# EAGLE design valentines-heart-punk-r1.1 (EAGLE 5.12)
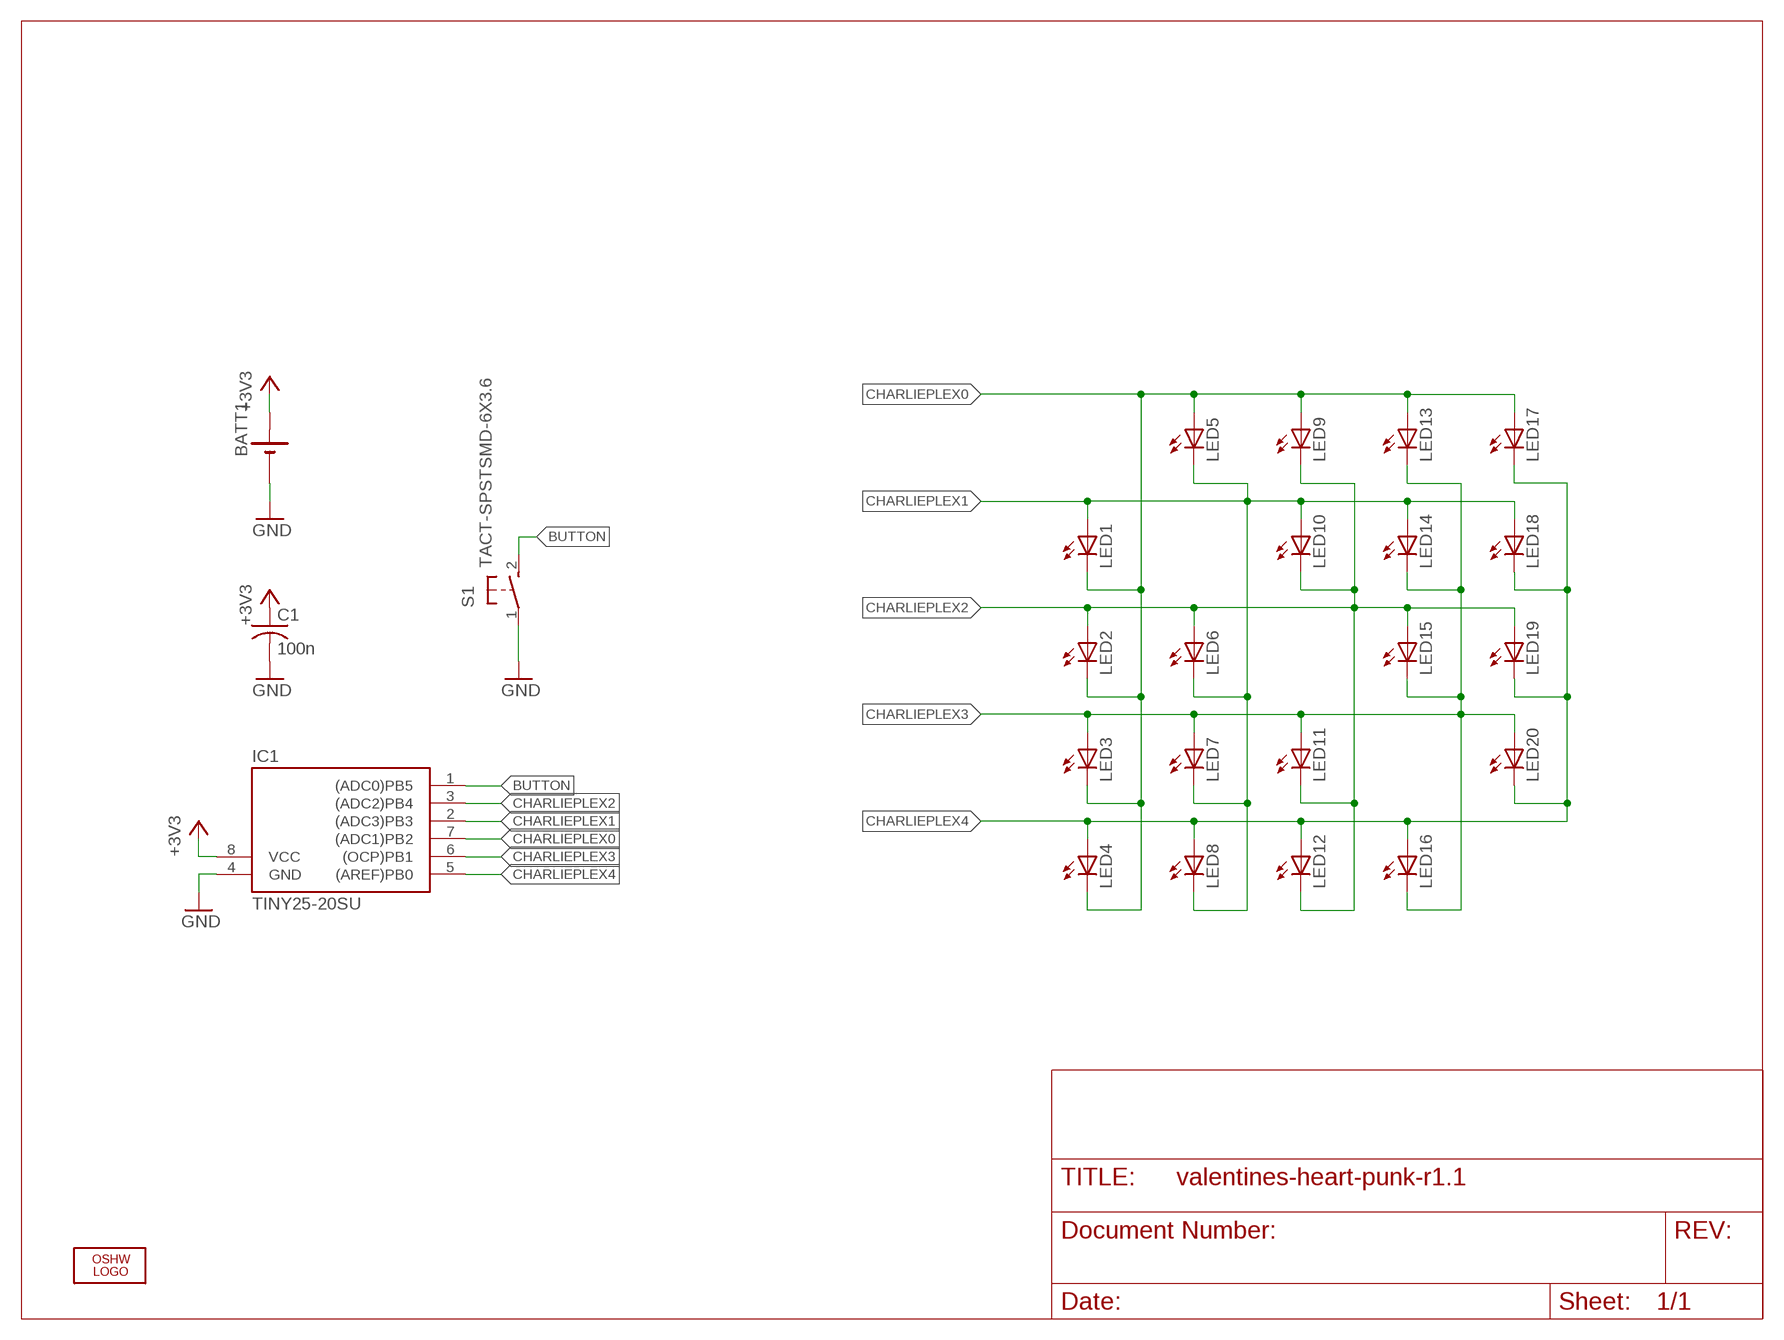
[diagram p0: schematic, sheet 1]

## Parts
BATT1  2032SMD  [2032SMD]
C1  100n  C-USC0603  [C0603]
IC1  TINY25-20SU  [SOIC8]
LED1  LEDCHIPLED_0805  [CHIPLED_0805]
LED2  LEDCHIPLED_0805  [CHIPLED_0805]
LED3  LEDCHIPLED_0805  [CHIPLED_0805]
LED4  LEDCHIPLED_0805  [CHIPLED_0805]
LED5  LEDCHIPLED_0805  [CHIPLED_0805]
LED6  LEDCHIPLED_0805  [CHIPLED_0805]
LED7  LEDCHIPLED_0805  [CHIPLED_0805]
LED8  LEDCHIPLED_0805  [CHIPLED_0805]
LED9  LEDCHIPLED_0805  [CHIPLED_0805]
LED10  LEDCHIPLED_0805  [CHIPLED_0805]
LED11  LEDCHIPLED_0805  [CHIPLED_0805]
LED12  LEDCHIPLED_0805  [CHIPLED_0805]
LED13  LEDCHIPLED_0805  [CHIPLED_0805]
LED14  LEDCHIPLED_0805  [CHIPLED_0805]
LED15  LEDCHIPLED_0805  [CHIPLED_0805]
LED16  LEDCHIPLED_0805  [CHIPLED_0805]
LED17  LEDCHIPLED_0805  [CHIPLED_0805]
LED18  LEDCHIPLED_0805  [CHIPLED_0805]
LED19  LEDCHIPLED_0805  [CHIPLED_0805]
LED20  LEDCHIPLED_0805  [CHIPLED_0805]
LOGO1  OSHW_LOGO_FILLX0100-NT  [OSHW_FILLX100_NOTEXT]
S1  TACT-SPSTSMD-6X3.6  [6X3.6-SPST]

## Nets
+3V3: BATT1.+ C1.1 IC1.8(VCC)
BUTTON: IC1.1((ADC0)PB5) S1.2(S)
CHARLIEPLEX0: IC1.7((ADC1)PB2) LED1.C LED2.C LED3.C LED4.C LED5.A LED9.A LED13.A LED17.A
CHARLIEPLEX1: IC1.2((ADC3)PB3) LED1.A LED5.C LED6.C LED7.C LED8.C LED10.A LED14.A LED18.A
CHARLIEPLEX2: IC1.3((ADC2)PB4) LED2.A LED6.A LED9.C LED10.C LED11.C LED12.C LED15.A LED19.A
CHARLIEPLEX3: IC1.6((OCP)PB1) LED3.A LED7.A LED11.A LED13.C LED14.C LED15.C LED16.C LED20.A
CHARLIEPLEX4: IC1.5((AREF)PB0) LED4.A LED8.A LED12.A LED16.A LED17.C LED18.C LED19.C LED20.C
GND: BATT1.- C1.2 IC1.4(GND) S1.1(P)

## Library data of the parts
BATT1 = rbg-4ucon-battery:2032SMD
C1 = rcl:C-US: CAPACITOR, American symbol
IC1 = avr-5-4.16:TINY25
LED1-LED20 = led:LED: LED OSRAM: - CHIPLED LG R971, LG N971, LY N971, LG Q971, LY Q971, LO R971, LY R971 LH N974, LH R974 LS Q976, LO Q976, LY Q976 LO Q996 - Hyper CHIPLED LW Q18S LB Q993, LB Q99A, LB R99A - SideLED LS A670, LO A670, LY A670, LG A670, LP A670 LB A673, LV A673, LT A673, LW A673 LH A674 LY A675 LS A676, LA A676, LO A676, LY A676, LW A676 LS A679, LY A679, LG A679 - Hyper Micro SIDELED® LS Y876, LA Y876, LO Y876, LY Y876 LT Y87S - SmartLED LW L88C, LW L88S LB L89C, LB L89S, LG L890 LS L89K, LO L89K, LY L89K LS L896, LA L896, LO L896, LY L896 - TOPLED LS T670, LO T670, LY T670, LG T670, LP T670 LSG T670, LSP T670, LSY T670, LOP T670, LYG T670 LG T671, LOG T671, LSG T671 LB T673, LV T673, LT T673, LW T673 LH T674 LS T676, LA T676, LO T676, LY T676, LB T676, LH T676, LSB T676, LW T676 LB T67C, LV T67C, LT T67C, LS T67K, LO T67K, LY T67K, LW E67C LS E67B, LA E67B, LO E67B, LY E67B, LB E67C, LV E67C, LT E67C LW T67C LS T679, LY T679, LG T679 LS T770, LO T770, LY T770, LG T770, LP T770 LB T773, LV T773, LT T773, LW T773 LH T774 LS E675, LA E675, LY E675, LS T675 LS T776, LA T776, LO T776, LY T776, LB T776 LHGB T686 LT T68C, LB T68C - Hyper Mini TOPLED® LB M676 - Mini TOPLED Santana® LG M470 LS M47K, LO M47K, LY M47K Source: http://www.osram.convergy.de LUXEON: - LUMILED® LXK2-PW12-R00, LXK2-PW12-S00, LXK2-PW14-U00, LXK2-PW14-V00 LXK2-PM12-R00, LXK2-PM12-S00, LXK2-PM14-U00 LXK2-PE12-Q00, LXK2-PE12-R00, LXK2-PE12-S00, LXK2-PE14-T00, LXK2-PE14-U00 LXK2-PB12-K00, LXK2-PB12-L00, LXK2-PB12-M00, LXK2-PB14-N00, LXK2-PB14-P00, LXK2-PB14-Q00 LXK2-PR12-L00, LXK2-PR12-M00, LXK2-PR14-Q00, LXK2-PR14-R00 LXK2-PD12-Q00, LXK2-PD12-R00, LXK2-PD12-S00 LXK2-PH12-R00, LXK2-PH12-S00 LXK2-PL12-P00, LXK2-PL12-Q00, LXK2-PL12-R00 Source: www.luxeon.com KINGBRIGHT: KA-3528ASYC Source: www.kingbright.com
LOGO1 = ohw-logo:OSHW_LOGO_FILL
S1 = rbg-generic-tact-switch:TACT-SPST

## Board
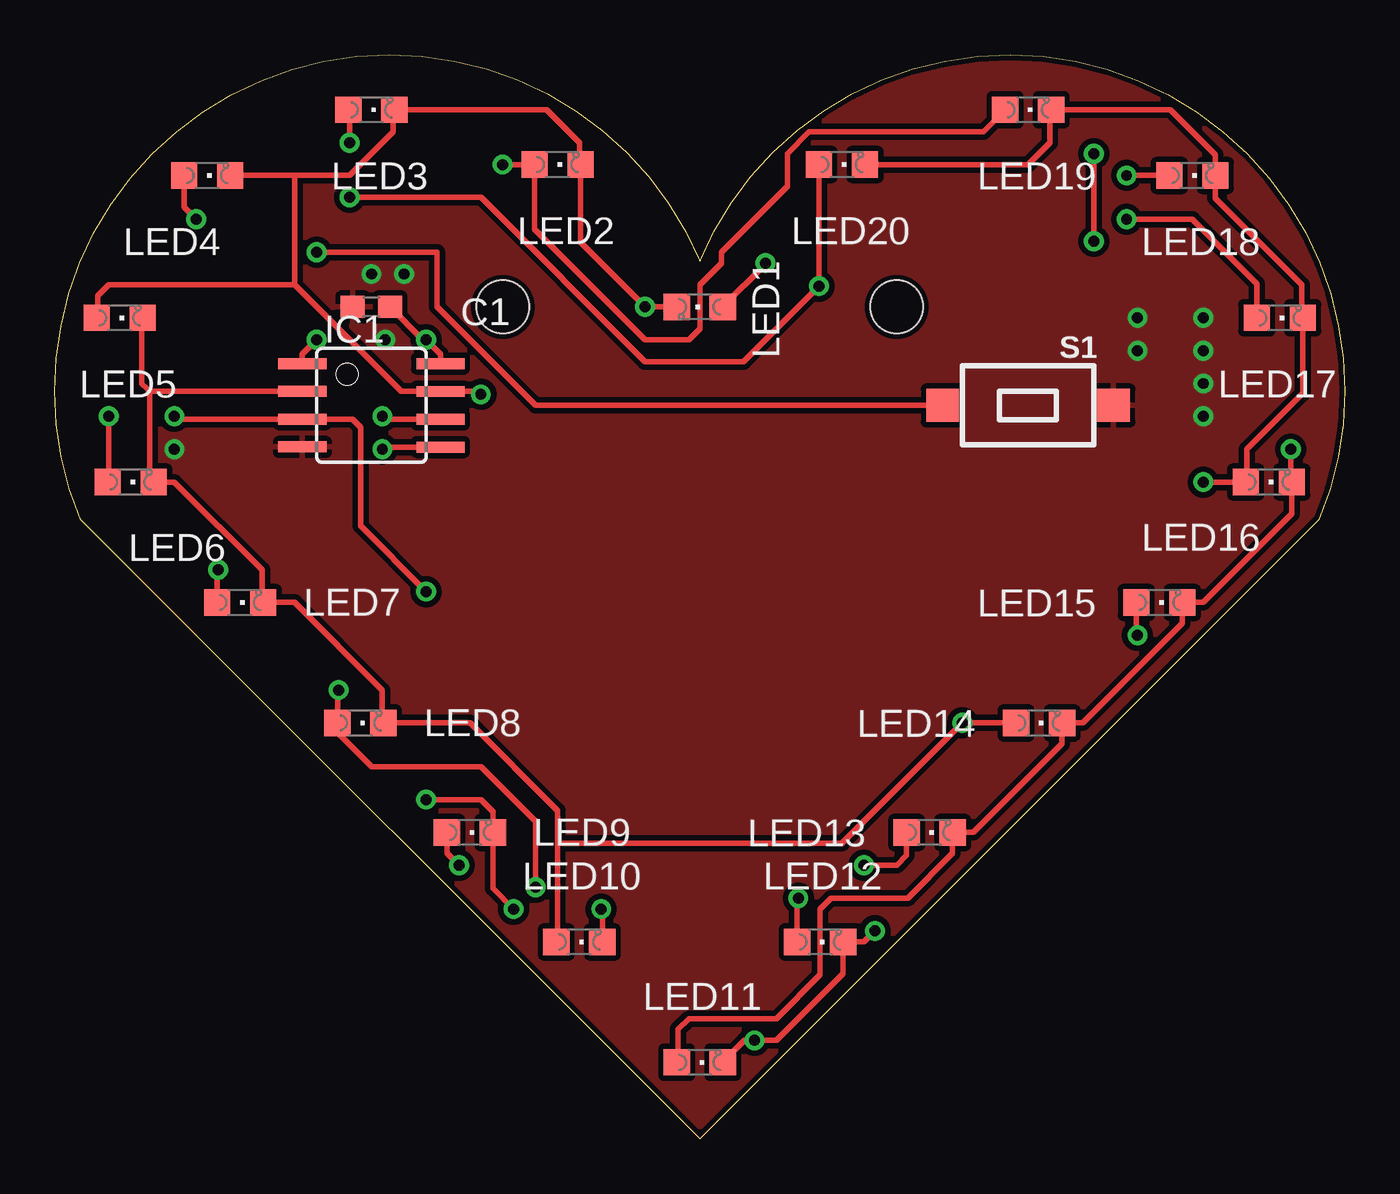
[diagram p1: board, top side]
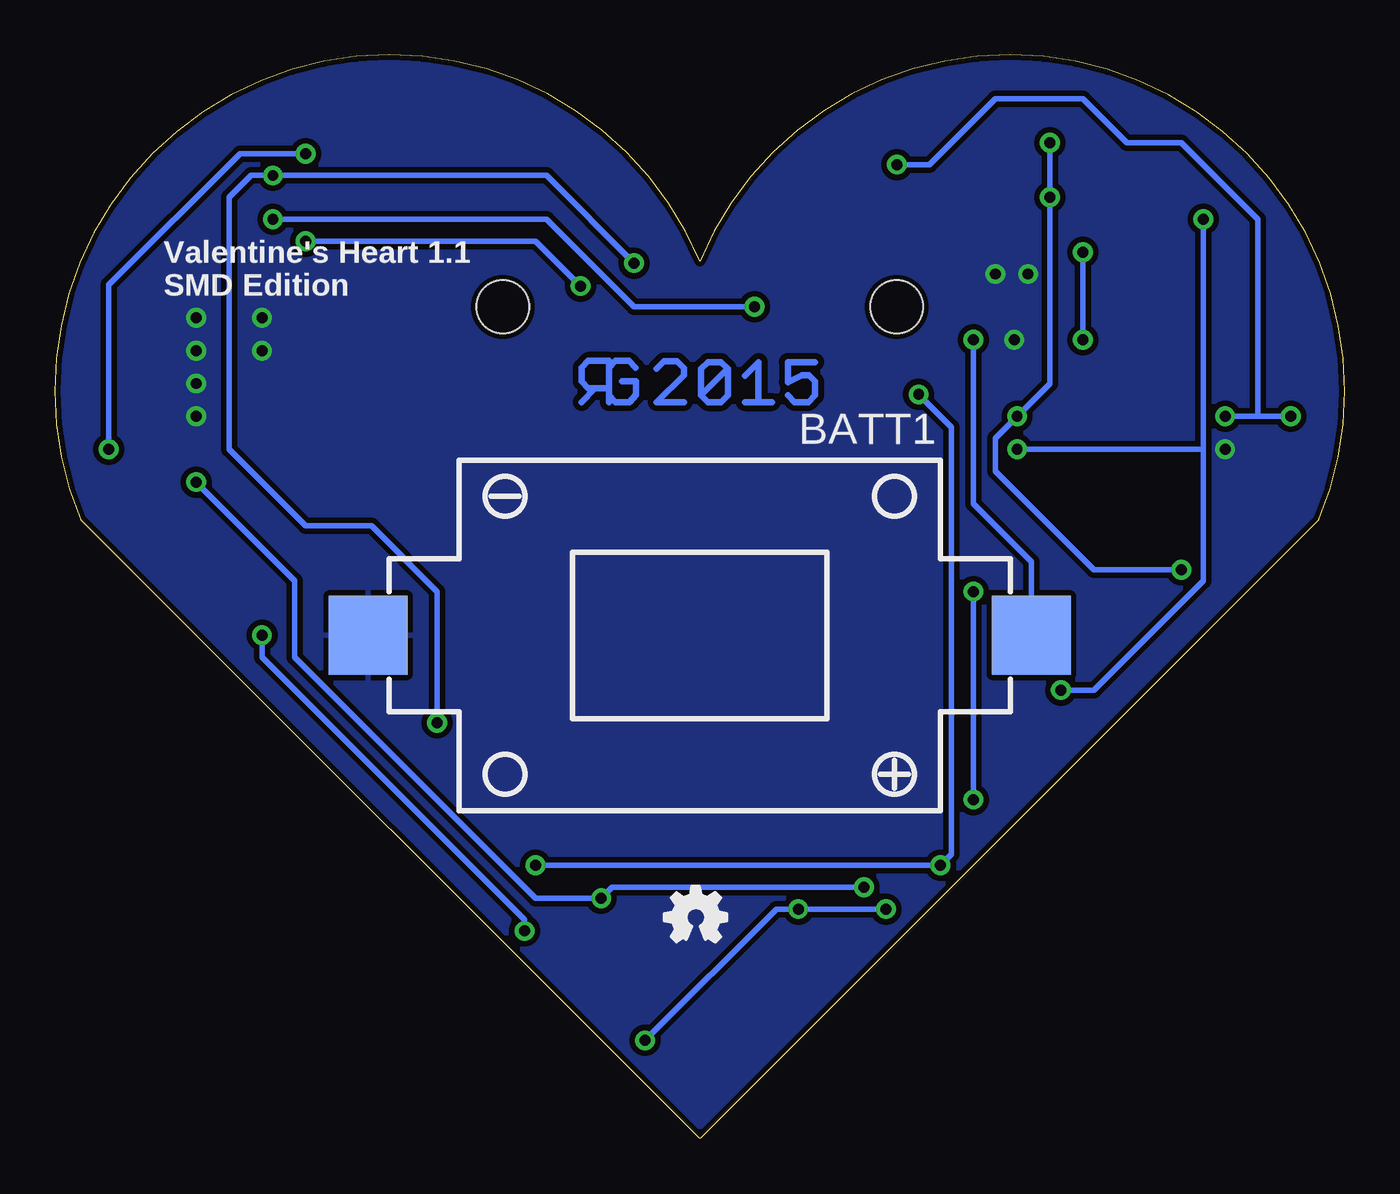
[diagram p2: board, bottom side, seen from below]

Size 58.93 x 49.51 mm. Coordinates in mm from the lower left corner, seen from the top.
Outline: 29.47,0 57.75,28.28 arc180 29.47,40.09 arc180 1.18,28.28 29.47,0
Copper layers (1*16): Top 0.035mm / dielectric 1.5mm / Bottom 0.035mm
Design rules "default *": minimum track width 10mil, minimum drill 0.5mm, track to track 8mil, track to pad 8mil, pad to pad 8mil, via to via 8mil, smd to smd 8mil, copper to edge 10mil, drill to drill 8mil, minimum pad ring 10mil, minimum via ring 8mil, stop-mask expansion 4mil, vias tented up to drill 20mil, thermal gap 10mil
Holes 2.4 mm at 20.47,38 38.47,38

### Footprints (pad centres in the part's own frame; a part is rotated, then mirrored left to right if it is on the bottom)
2032SMD = smd 3.6 x 3.6: + -15.15,0; - 15.15,0
C0603 = smd 1.1 x 1: 1 -0.85,0; 2 0.85,0
SOIC8 = smd 0.5 x 2.2: 1 -1.905,-3.154; 2 -0.645,-3.154; 3 0.625,-3.154; 4 1.895,-3.154; 5 1.905,3.154; 6 0.635,3.154; 7 -0.635,3.154; 8 -1.905,3.154
CHIPLED_0805 = smd 1.2 x 1.2: A 0,-1.05; C 0,1.05
6X3.6-SPST = smd 1.5 x 1.5: 1 -3.9,0; 2 3.9,0

### Placement (x,y rotation side)
BATT1  29.47,23 180 bottom
C1  14.47,38 180 top
IC1  14.47,33.5 270 top
LED1  29.47,38 90 top
LED2  22.97,44.5 270 top
LED3  14.47,47 270 top
LED4  6.97,44 270 top
LED5  2.97,37.5 270 top
LED6  3.47,30 270 top
LED7  8.47,24.5 270 top
LED8  13.97,19 270 top
LED9  18.97,14 270 top
LED10  23.97,9 270 top
LED11  29.47,3.5 270 top
LED12  34.97,9 270 top
LED13  39.97,14 270 top
LED14  44.97,19 270 top
LED15  50.47,24.5 270 top
LED16  55.47,30 270 top
LED17  55.97,37.5 270 top
LED18  51.97,44 270 top
LED19  44.47,47 270 top
LED20  35.97,44.5 270 top
LOGO1  31.07,9 0 bottom
S1  44.47,33.5 180 top
U$1  [RGLOGO_SMALL_2015]  33.47,33.5 0 bottom

### Tracks (layer width: path | path; a pad name or v marks a point on that pad's centre or on a via)
+3V3  (via drill 0.5)
  Top 0.254: v16.97,36.5 16.82,36.5 C1.1 | v16.97,36.5 17.08,36.38 | IC1.8 17.62,35.85 v16.97,36.5
  Bottom 0.254: BATT1.+ 14.32,26.35 16.97,29 v16.97,36.5
BUTTON  (via drill 0.5)
  Top 0.254: S1.2 21.97,33.5 17.47,38 17.47,40.5 v11.97,40.5 | IC1.1 11.31,35.85 v11.97,36.5
  Bottom 0.254: v11.97,36.5 v11.97,40.5
CHARLIEPLEX0  (via drill 0.5)
  Top 0.254: LED1.C v26.97,38 24.02,40.95 LED2.C 23.97,44.55 23.97,45.5 22.47,47 LED3.C 15.47,46.95 15.47,46 13.47,44 10.97,44 | 10.97,44 LED4.C | 10.97,39 2.47,39 1.97,38.5 1.97,37.55 LED5.A | 10.97,39 15.83,34.13 IC1.7 19.33,34.13 v19.47,34 | LED9.A 17.92,13.05 v18.47,12.5 | LED13.A 38.92,12.95 38.47,12.5 v36.97,12.5 | LED17.A 54.92,39.05 51.97,42 v48.97,42 | 10.97,39 10.97,44
  Bottom 0.254: v36.97,12.5 v18.47,12.5 17.97,13 17.97,32.5 v19.47,34 | v48.97,42 36.47,42 32.47,38 v26.97,38
CHARLIEPLEX1  (via drill 0.5)
  Top 0.254: 4.32,34.15 4.33,34.13 4.33,30.18 LED6.C 5.47,30 9.47,26 9.47,24.55 LED7.C 10.97,24.5 14.97,20.5 14.97,19.05 LED8.C 18.97,19 22.97,15 22.97,13.5 | LED5.C 3.97,37.45 3.97,34.5 4.22,34.25 4.32,34.15 | 22.97,13.5 22.97,9.05 LED10.A | 22.97,13.5 35.97,13.5 v41.47,19 LED14.A | v48.97,44 LED18.A | v32.47,40 32.47,39.95 LED1.A | 4.32,34.15 IC1.2
  Bottom 0.254: v32.47,40 36.47,44 v48.97,44 49.97,44 50.97,43 50.97,31.5 47.47,28 44.47,28 41.47,25 v41.47,19
CHARLIEPLEX2  (via drill 0.5)
  Top 0.254: 5.6,32.87 v5.47,33 5.59,32.88 IC1.3 11.32,32.87 13.6,32.87 13.97,32.5 13.97,28 v16.97,25 | v2.47,33 2.47,30.05 LED6.A | LED19.A 42.42,46 34.47,46 33.47,45 33.47,43.5 30.47,40.5 30.47,40 29.47,39 29.47,37 28.97,36.5 26.97,36.5 21.92,41.55 LED2.A v20.47,44.5 | v20.97,10.5 20.02,11.45 LED9.C 20.02,14.95 19.47,15.5 v16.97,15.5 | LED10.C 25.02,10.45 v24.97,10.5 | LED15.A 49.42,23.05 v49.47,23 | v37.47,9.5 36.97,9 LED12.C 36.02,7.55 32.97,4.5 v31.97,4.5 31.52,4.5 LED11.C
  Bottom 0.254: v2.47,33 3.97,33 | 3.97,33 v5.47,33 | v20.97,10.5 v24.97,10.5 25.97,10.5 v31.97,4.5 | v49.47,23 49.47,22 37.47,10 v37.47,9.5 | v20.47,44.5 18.97,44.5 15.97,47.5 11.97,47.5 9.97,45.5 7.47,45.5 3.97,42 3.97,33 | v16.97,25 v16.97,15.5
CHARLIEPLEX3  (via drill 0.5)
  Top 0.254: LED11.A 28.47,3.55 28.47,5 28.97,5.5 32.97,5.5 34.97,7.5 34.97,10.5 35.47,11 38.97,11 41.02,13.05 LED13.C 41.97,14 46.02,18.05 LED14.C 46.97,19 51.52,23.55 LED15.C 52.47,24.5 56.52,28.55 LED16.C 56.47,30.05 v56.47,31.5 | v13.47,45.5 13.47,47 LED3.A | LED7.A 7.42,25.95 v7.47,26 | v13.47,43 19.47,43 26.97,35.5 31.47,35.5 v34.92,38.95 LED20.A | v47.47,45 v47.47,41 | IC1.6 15.1,32.87 v14.97,33
  Bottom 0.254: v13.47,45.5 v13.47,43 13.47,34.5 v14.97,33 15.97,32 15.97,30.5 11.47,26 v7.47,26 | v34.92,38.95 36.97,41 v47.47,41 | v47.47,45 50.47,45 56.47,39 v56.47,31.5
CHARLIEPLEX4  (via drill 0.5)
  Top 0.254: LED20.C 44.47,44.5 45.47,45.5 45.47,46.95 LED19.C 50.97,47 53.02,44.95 LED18.C 53.02,42.95 56.97,39 56.97,37.55 LED17.C 57.02,34.05 54.47,31.5 54.47,30.05 LED16.A v52.47,30 | LED4.A 5.92,42.55 v6.47,42 | v12.97,20.5 12.92,20.45 LED8.A 12.92,18.55 14.47,17 19.47,17 21.97,14.5 v21.97,11.5 | LED12.A 33.92,10.95 v33.97,11 | IC1.5 15.06,31.59 v14.97,31.5
  Bottom 0.254: 6.47,31.5 v6.47,42 | 6.47,31.5 v14.97,31.5 | v12.97,20.5 11.47,20.5 6.47,25.5 6.47,31.5 | v52.47,30 47.97,25.5 47.97,22 36.97,11 v33.97,11 33.47,11.5 v21.97,11.5
GND  (via drill 0.5)
  other vias: 52.47,37.5 52.47,36 52.47,34.5 52.47,33 49.47,37.5 49.47,36 14.47,39.5 15.97,39.5 15.1,36.5 5.47,31.5
  pour Bottom (isolate 0.254): -0.53,51 60.47,51 60.47,-4.5 -0.53,-4.5
  pour Top (isolate 0.254): -0.53,51 60.47,51 60.47,-4.5 -0.53,-4.5

### Text on the board
bNames: Valentine's Heart 1.1 | SMD Edition